# Altium schematic sheet PF8_AudioOutput.SchDoc
size A
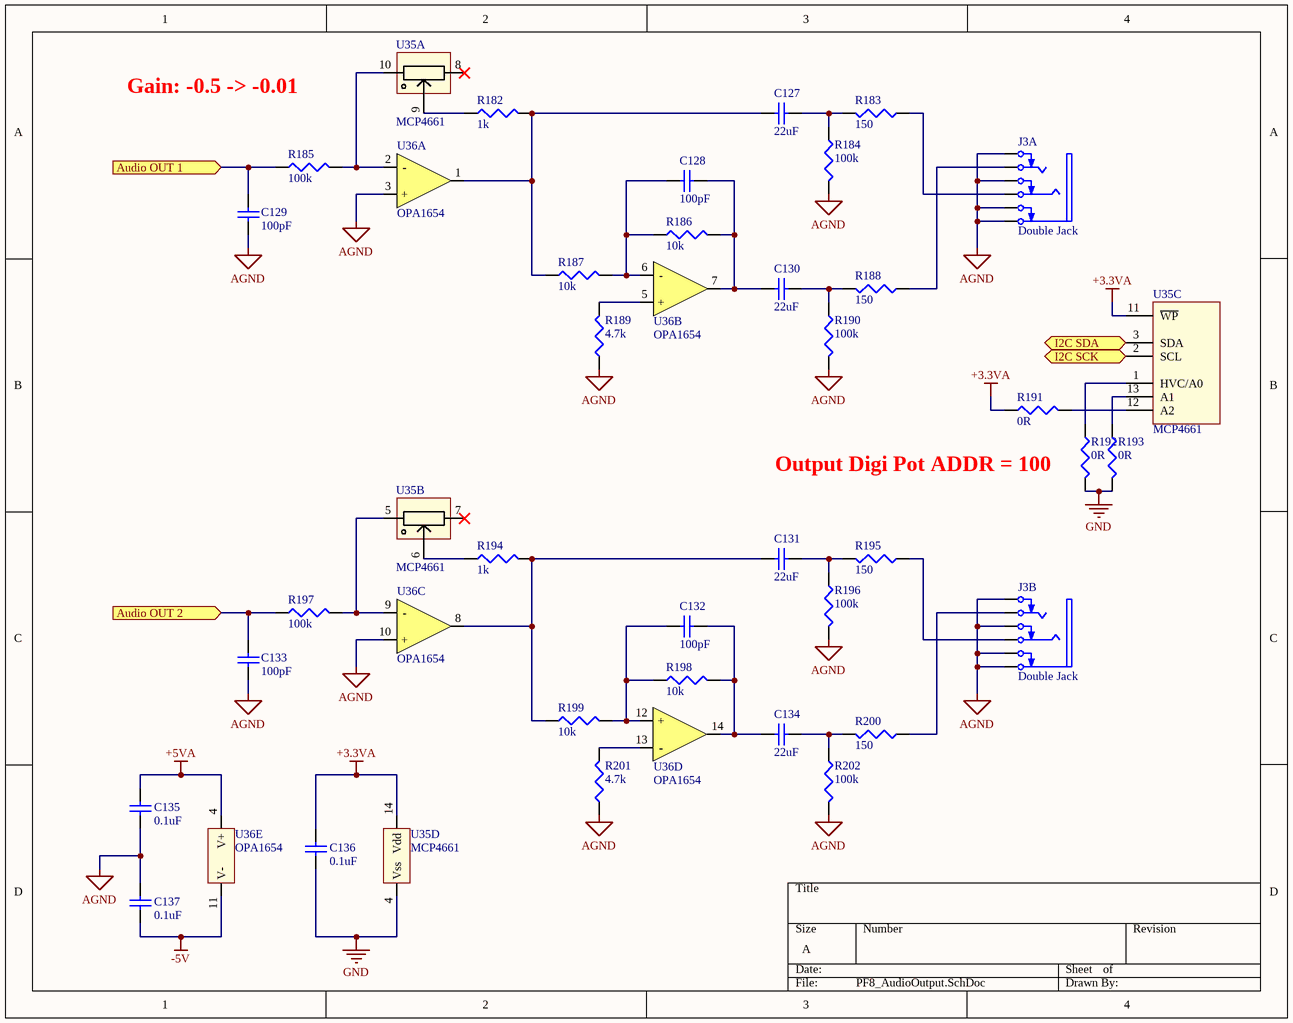
[diagram p0: PF8_AudioOutput.SchDoc]

## Parts
C127  22uF  [CAP 0603 (1608 metric)]
C128  100pF  [CAP 0603 (1608 metric)]
C129  100pF  [CAP 0603 (1608 metric)]
C130  22uF  [CAP 0603 (1608 metric)]
C131  22uF  [CAP 0603 (1608 metric)]
C132  100pF  [CAP 0603 (1608 metric)]
C133  100pF  [CAP 0603 (1608 metric)]
C134  22uF  [CAP 0603 (1608 metric)]
C135  0.1uF  [C1206]
C136  0.1uF  [C1206]
C137  0.1uF  [C1206]
J3  Double Jack  [JACK/6-V4A]  (parts A,B of 2)
R182  1k  [RES 0603 (1608 metric)]
R183  150  [RES 0603 (1608 metric)]
R184  100k  [RES 0603 (1608 metric)]
R185  100k  [RES 0603 (1608 metric)]
R186  10k  [RES 0603 (1608 metric)]
R187  10k  [RES 0603 (1608 metric)]
R188  150  [RES 0603 (1608 metric)]
R189  4.7k  [RES 0603 (1608 metric)]
R190  100k  [RES 0603 (1608 metric)]
R191  0R  [RES 0603 (1608 metric)]
R192  0R  [RES 0603 (1608 metric)]
R193  0R  [RES 0603 (1608 metric)]
R194  1k  [RES 0603 (1608 metric)]
R195  150  [RES 0603 (1608 metric)]
R196  100k  [RES 0603 (1608 metric)]
R197  100k  [RES 0603 (1608 metric)]
R198  10k  [RES 0603 (1608 metric)]
R199  10k  [RES 0603 (1608 metric)]
R200  150  [RES 0603 (1608 metric)]
R201  4.7k  [RES 0603 (1608 metric)]
R202  100k  [RES 0603 (1608 metric)]
U35  MCP4661  [TSSOP14_MC]  (parts A,B,C,D of 4)
U36  OPA1654  [D14]  (parts A,B,C,D,E of 5)

## Ports
Audio OUT 1 (in), Audio OUT 2 (in), I2C SCK, I2C SDA

## Nets
+3.3VA: C136.1 R191.1 U35.11(~{WP}) U35.14(Vdd)
+5VA: C135.1 U36.4(V+)
-5V: C137.2 U36.11(V-)
AGND: C129.1 C133.1 C135.2 C137.1 J3.1(SB) J3.2(RB) J3.3(TB) J3.4(S) J3.7(SB) J3.8(RB) J3.9(TB) J3.10(S) R184.2 R189.1 R190.2 R196.2 R201.1 R202.2 U36.3(+) U36.10(+)
GND: C136.2 R192.2 R193.2 U35.4(Vss)
Audio OUT 1: C129.2 R185.1 ; port Audio OUT 1
Audio OUT 2: C133.2 R197.1 ; port Audio OUT 2
I2C SCK: U35.2(SCL) ; port I2C SCK
I2C SDA: U35.3(SDA) ; port I2C SDA
NetC127_1: C127.1 R183.2 R184.1
NetC127_2: C127.2 R182.2 R187.1 U36.1(OUT)
NetC128_1: C128.1 C130.2 R186.2 U36.7(OUT)
NetC128_2: C128.2 R186.1 R187.2 U36.6(-)
NetC130_1: C130.1 R188.2 R190.1
NetC131_1: C131.1 R195.2 R196.1
NetC131_2: C131.2 R194.2 R199.1 U36.8(OUT)
NetC132_1: C132.1 C134.2 R198.2 U36.14(OUT)
NetC132_2: C132.2 R198.1 R199.2 U36.12(+)
NetC134_1: C134.1 R200.2 R202.1
NetJ3_5: J3.5(R) R195.1
NetJ3_6: J3.6(T) R200.1
NetJ3_11: J3.11(R) R183.1
NetJ3_12: J3.12(T) R188.1
NetR182_1: R182.1 U35.9(P0W)
NetR185_2: R185.2 U35.10(P0B) U36.2(-)
NetR189_2: R189.2 U36.5(+)
NetR191_2: R191.2 U35.12(A2)
NetR192_1: R192.1 U35.1(HVC/A0)
NetR193_1: R193.1 U35.13(A1)
NetR194_1: R194.1 U35.6(P1W)
NetR197_2: R197.2 U35.5(P1B) U36.9(-)
NetR201_2: R201.2 U36.13(-)

Not connected (* = marked no-connect by the designer): U35 7(P1A)* 8(P0A)*

## Notes on the sheet
- Gain: -0.5 -> -0.01
- Output Digi Pot ADDR = 100

## Library data of the parts
C127 C130 C131 C134 = Cap Semi: Capacitor (Semiconductor SIM Model); Fabricant: MURATA; Fournisseur: Farnell; RefFabricant: GRM188R60J226MEA0D; RefFournisseur: 2666490; Value: 22uF; Case: 0603 [1608 Metric]; DataSheet: http://www.farnell.com/datasheets/1910934.pdf
C128 C129 C132 C133 = Cap Semi: Capacitor (Semiconductor SIM Model); Fabricant: MURATA; Fournisseur: Farnell; RefFabricant: GRT1885C1H101JA02D; RefFournisseur: 2672133; Value: 100pF; Case: 0603 [1608 Metric]; DataSheet: http://www.farnell.com/datasheets/2165936.pdf
C135-C137 = Cap Semi: Capacitor (Semiconductor SIM Model); Fabricant: MURATA; Fournisseur: Farnell; RefFabricant: GRM188F51E104ZA01D; RefFournisseur: 2821272; Value: 0.1uF; Case: 0603 [1608 Metric]; DataSheet: http://www.farnell.com/datasheets/2048672.pdf
J3 = Dual TRS Jack Bypassed: Dual Jack stereo bypassed; PackageDocument: 2003; PCB_Layout: Complies with manufacturer's recommendation.; DrillAndSlotSize: Corresponds to nominal value.; Published: 15-Jul-2004; DatasheetDocument: 2003; PackageReference: S1VS_SBS; Publisher: Altium Limited; ComponentLink1Description: Manufacturer Link; ComponentLink1URL: http://www.cliffuk.co.uk/
R182 R194 = Res3: Resistor; Fabricant: KEMET; Fournisseur: Farnell; RefFabricant: CPF-A-0603B1K0E1; RefFournisseur: 2483880; Value: 1k; Case: 0603 [1608 Metric]; DataSheet: http://www.farnell.com/datasheets/1935020.pdf
R183 R188 R195 R200 = Res3: Resistor; Value: 150k; Fabricant: KEMET; Fournisseur: Farnell; RefFabricant: CPF0603B150KE1; RefFournisseur: 2330937; Case: 0603 [1608 Metric]; DataSheet: http://www.farnell.com/datasheets/2104089.pdf
R184 R185 R190 R196 R197 R202 = Res3: Resistor; Fabricant: KEMET; Fournisseur: Farnell; RefFabricant: RN73C1J100KBTDF; RefFournisseur: 2687850; Value: 100k; Case: 0603 [1608 Metric]; DataSheet: http://www.farnell.com/datasheets/2189072.pdf
R186 R187 R189 R198 R199 R201 = Res3: Resistor; Fabricant: TE CONNECTIVITY; Fournisseur: Farnell; RefFabricant: CPF-A-0603B4K7E1; RefFournisseur: 2483933; Case: 0603 [1608 Metric]; DataSheet: http://www.farnell.com/datasheets/1935020.pdf
  R186 R187 R198 R199: Value: 10k
  R189 R201: Value: 4.7k
R191-R193 = Res3: Resistor; Value: 0
U35 = MCP4661: Dual DigiPot non volatile I2C; Fabricant: Microchip; Fournisseur: Farnell; RefFabricant: MCP4661-503E/ST; RefFournisseur: 1840724; DataSheet: http://www.farnell.com/datasheets/2243913.pdf
U36 = OPA1654: Quad Audio OpAmp; Fabricant: Texas Instruments; Fournisseur: Farnell; RefFabricant: OPA1654AID; RefFournisseur: 2099889; DataSheet: http://www.ti.com/lit/ds/symlink/opa1654.pdf